# EAGLE design Circuit (EAGLE 9.6.2)
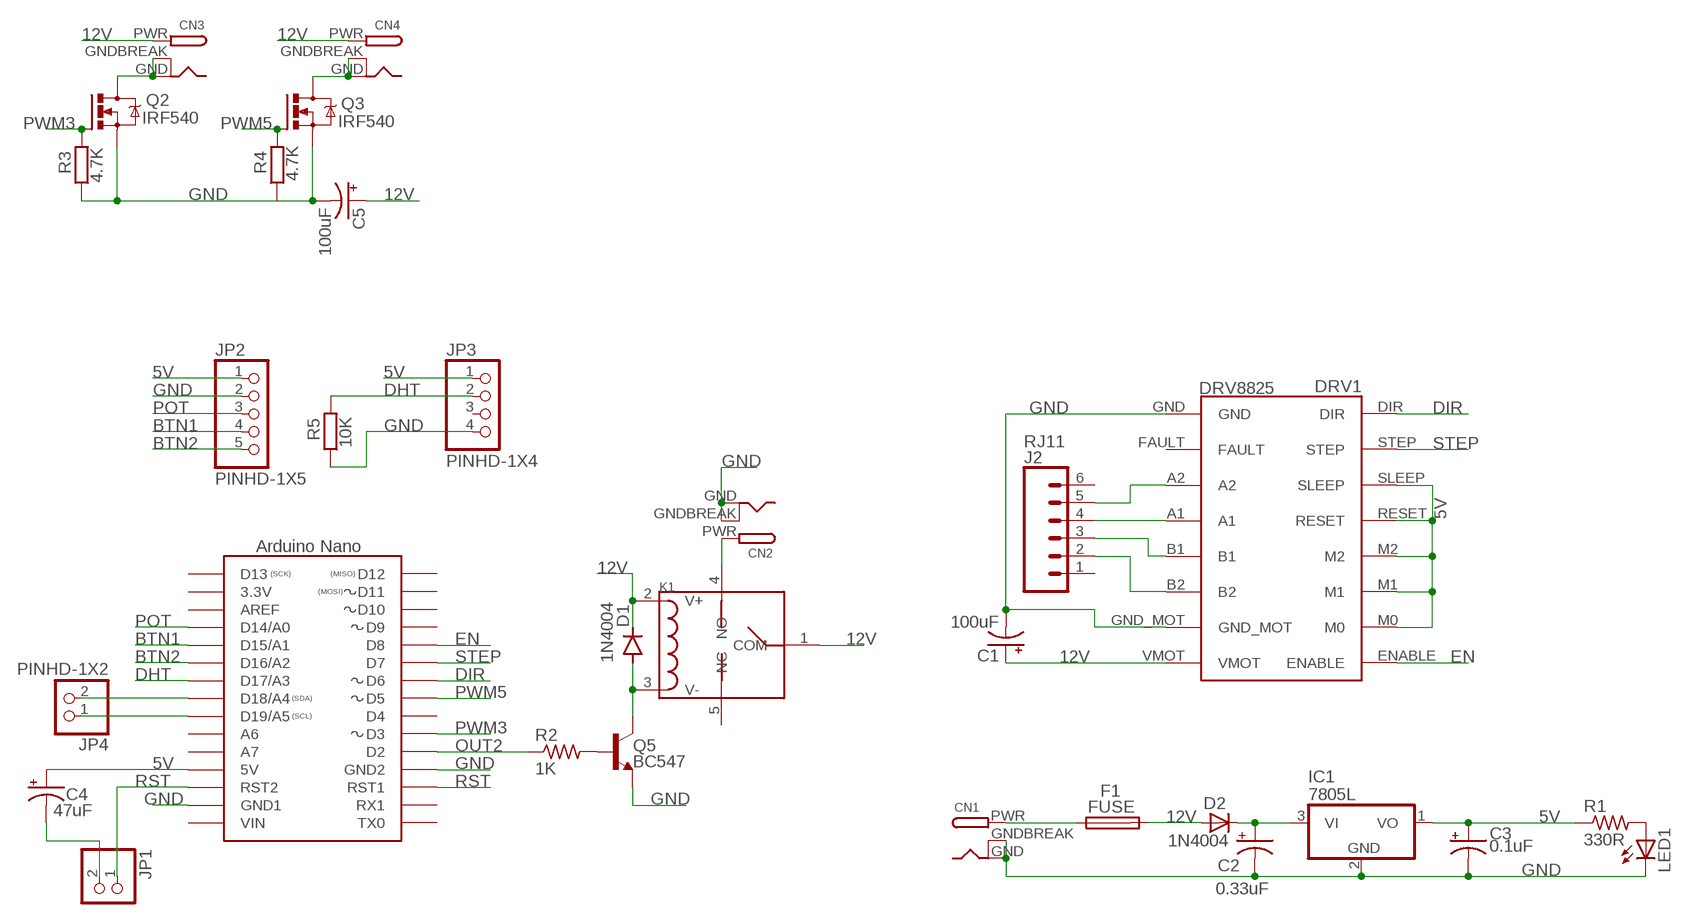
[diagram p0: schematic, sheet 1]

## Parts
C1  100uF  CPOL-USE2.5-6  [E2,5-6]
C2  0.33uF  CPOL-USE2-5  [E2-5]
C3  0.1uF  CPOL-USE2-5  [E2-5]
C4  47uF  CPOL-USE2.5-6  [E2,5-6]
C5  100uF  CPOL-USE2.5-6  [E2,5-6]
CN1  DCBARRELPTH  [DCJACK_2MM_PTH]
CN2  DCBARRELPTH  [DCJACK_2MM_PTH]
CN3  DCBARRELPTH  [DCJACK_2MM_PTH]
CN4  DCBARRELPTH  [DCJACK_2MM_PTH]
D1  1N4004  [DO41-10]
D2  1N4004  [DO41-10]
DRV1  DRV8825  [DRV8825]
F1  FUSE  FUSESH22,5  [SH22,5]
IC1  7805L  [TO92]
J2  RJ11  RJ11-6  [RJ11-6]
JP1  PINHD-1X2  [1X02]
JP2  PINHD-1X5  [1X05]
JP3  PINHD-1X4  [1X04]
JP4  PINHD-1X2  [1X02]
K1  RELAY-HLS8L-DC5V-S-CHLS8L-DC5V-S-C  [REY5-19.0X15.0X15.0MM]
LED1  LED5MM  [LED5MM]
Q2  IRF540  [TO220BV]
Q3  IRF540  [TO220BV]
Q5  BC547  TRANS_NPN-2N3904  [TO-92]
R1  330R  R-US_0204/7  [0204/7]
R2  1K  R-US_0204/7  [0204/7]
R3  4.7K  R-EU_0204/5  [0204/5]
R4  4.7K  R-EU_0204/5  [0204/5]
R5  10K  R-EU_0204/5  [0204/5]
U$1  NANO  [NANO]

## Nets
5V: C3.+ C4.+ DRV1.M0 DRV1.M1 DRV1.M2 DRV1.RESET DRV1.SLEEP IC1.1(VO) JP2.1 JP3.1 R1.1 U$1.5V
12V: C1.+ C5.+ CN3.PWR CN4.PWR D1.C D2.A DRV1.VMOT F1.2 K1.1(COM) K1.2(V+)
BTN1: JP2.4 U$1.A1(D15/A1)
BTN2: JP2.5 U$1.A2(D16/A2)
DHT: JP3.2 R5.2 U$1.A3(D17/A3)
DIR: DRV1.DIR U$1.D6
EN: DRV1.ENABLE U$1.D8
GND: C1.- C2.- C3.- C5.- CN1.GND CN1.GNDBREAK CN2.GND CN2.GNDBREAK DRV1.GND DRV1.GND_MOT IC1.2(GND) JP2.2 JP3.4 LED1.K(C) Q2.S Q3.S Q5.1(E) R3.1 R4.1 R5.1 U$1.GND1(GND2) U$1.GND(GND1)
N$1: LED1.A R1.2
N$2: Q5.2(B) R2.2
N$3: CN2.PWR K1.4(NO)
N$4: JP4.2 U$1.A4(D18/A4)
N$5: DRV1.A1 J2.4
N$6: D1.A K1.3(V-) Q5.3(C)
N$7: JP4.1 U$1.A5(D19/A5)
N$10: C4.- JP1.2
N$13: DRV1.B2 J2.2
N$14: DRV1.B1 J2.3
N$16: DRV1.A2 J2.5
N$19: CN1.PWR F1.1
N$21: CN3.GND CN3.GNDBREAK Q2.D
N$23: CN4.GND CN4.GNDBREAK Q3.D
N$24: C2.+ D2.C IC1.3(VI)
OUT2: R2.1 U$1.D2
POT: JP2.3 U$1.A0(D14/A0)
PWM3: Q2.G R3.2 U$1.D3
PWM5: Q3.G R4.2 U$1.D5
RST: JP1.1 U$1.RST1 U$1.RST(RST2)
STEP: DRV1.STEP U$1.D7
Unconnected: DRV1.FAULT J2.1 J2.6 JP3.3 K1.5(NC) U$1.3.3V U$1.A6 U$1.A7 U$1.AREF U$1.D4 U$1.D9 U$1.D10 U$1.D11 U$1.D12 U$1.D13 U$1.RAW(VIN) U$1.RX1 U$1.TX0

## Library data of the parts
C1-C5 = rcl:CPOL-US: POLARIZED CAPACITOR, American symbol; SPICEPREFIX: C
CN1-CN4 = adafruit:DCBARREL: 2.0mm DC Barrel Jack DCJACK_2MM_PTH - Through Hole Jack (4UConnector: 05537)
D1 = diode:1N4004: DIODE
D2 = adafruit:1N4004: DIODE
DRV1 = 1:DRV8825: DRV8825 Stepper motor driver; SPICEPREFIX: X
F1 = fuse:FUSE: Fuse; OC_FARNELL: unknown; OC_NEWARK: unknown
IC1 = adafruit:78*: Positive VOLTAGE REGULATOR Added bigger pads to the TO-92 package
J2 = SparkFun-Connectors:RJ11-6: RJ11 Jack - 6 pin Commonly found on CAT3 devices and some Microchip programmers. Here is the connector we sell at SparkFun: RJ11 6-Pin Connector <https://www.sparkfun.com/products/132> (PRT-00132) Datasheet <http://www.sparkfun.com/datasheets/Prototyping/Connectors/RJ11-Datasheet.pdf> It is used on this SparkFun product: SparkFun Weather Shield <https://www.sparkfun.com/products/12081> (DEV-12081) Weather Meters <https://www.sparkfun.com/products/8942> (SEN-08942); PROD_ID: CONN-08590; SF_ID: PRT-00132
JP1 = pinhead:PINHD-1X2: PIN HEADER
JP2 = Connector:PINHD-1X5: PIN HEADER; CATEGORY: CONNECTOR; SUB-CATEGORY: PIN-HEADER
JP3 = Connector:PINHD-1X4: PIN HEADER; CATEGORY: CONNECTOR; SUB-CATEGORY: PIN-HEADER
JP4 = Connector:PINHD-1X2: PIN HEADER; CATEGORY: CONNECTOR; SUB-CATEGORY: PIN-HEADER
K1 = OPL_Relay:RELAY-HLS8L-DC5V-S-C: 315030000
LED1 = adafruit:LED: LED OSRAM: - CHIPLED LG R971, LG N971, LY N971, LG Q971, LY Q971, LO R971, LY R971 LH N974, LH R974 LS Q976, LO Q976, LY Q976 LO Q996 - Hyper CHIPLED LW Q18S LB Q993, LB Q99A, LB R99A - SideLED LS A670, LO A670, LY A670, LG A670, LP A670 LB A673, LV A673, LT A673, LW A673 LH A674 LY A675 LS A676, LA A676, LO A676, LY A676, LW A676 LS A679, LY A679, LG A679 - Hyper Micro SIDELED® LS Y876, LA Y876, LO Y876, LY Y876 LT Y87S - SmartLED LW L88C, LW L88S LB L89C, LB L89S, LG L890 LS L89K, LO L89K, LY L89K LS L896, LA L896, LO L896, LY L896 - TOPLED LS T670, LO T670, LY T670, LG T670, LP T670 LSG T670, LSP T670, LSY T670, LOP T670, LYG T670 LG T671, LOG T671, LSG T671 LB T673, LV T673, LT T673, LW T673 LH T674 LS T676, LA T676, LO T676, LY T676, LB T676, LH T676, LSB T676, LW T676 LB T67C, LV T67C, LT T67C, LS T67K, LO T67K, LY T67K, LW E67C LS E67B, LA E67B, LO E67B, LY E67B, LB E67C, LV E67C, LT E67C LW T67C LS T679, LY T679, LG T679 LS T770, LO T770, LY T770, LG T770, LP T770 LB T773, LV T773, LT T773, LW T773 LH T774 LS E675, LA E675, LY E675, LS T675 LS T776, LA T776, LO T776, LY T776, LB T776 LHGB T686 LT T68C, LB T68C - Hyper Mini TOPLED® LB M676 - Mini TOPLED Santana® LG M470 LS M47K, LO M47K, LY M47K Source: http://www.osram.convergy.de/
Q2 Q3 = transistor-power:IRF540: HEXFET Power MOSFET
Q5 = SparkFun-DiscreteSemi:TRANS_NPN: NPN transistor Current controlled devices typically used to amplify current or used as a switch. BC547 - COM-08928 <http://www.sparkfun.com/products/8928> (TO-92 45V 100mA) (1.Collector 2.Base 3.Emitter) 2N3904 - COM-00521 <http://www.sparkfun.com/products/521> (TO-92 40V 200mA) (1.Emitter 2.Base 3.Collector) P2N2222A - COM-12852 <http://www.sparkfun.com/products/12852> (TO-92 40V 600mA) (1.Collector 2.Base 3.Emitter); PROD_ID: TRANS-08447; VALUE: 200mA/40V
R1 R2 = resistor:R-US_: RESISTOR, American symbol
R3-R5 = rcl:R-EU_: RESISTOR, European symbol; SPICEPREFIX: R
U$1 = Arduino:NANO: Arduino Nano

## Board
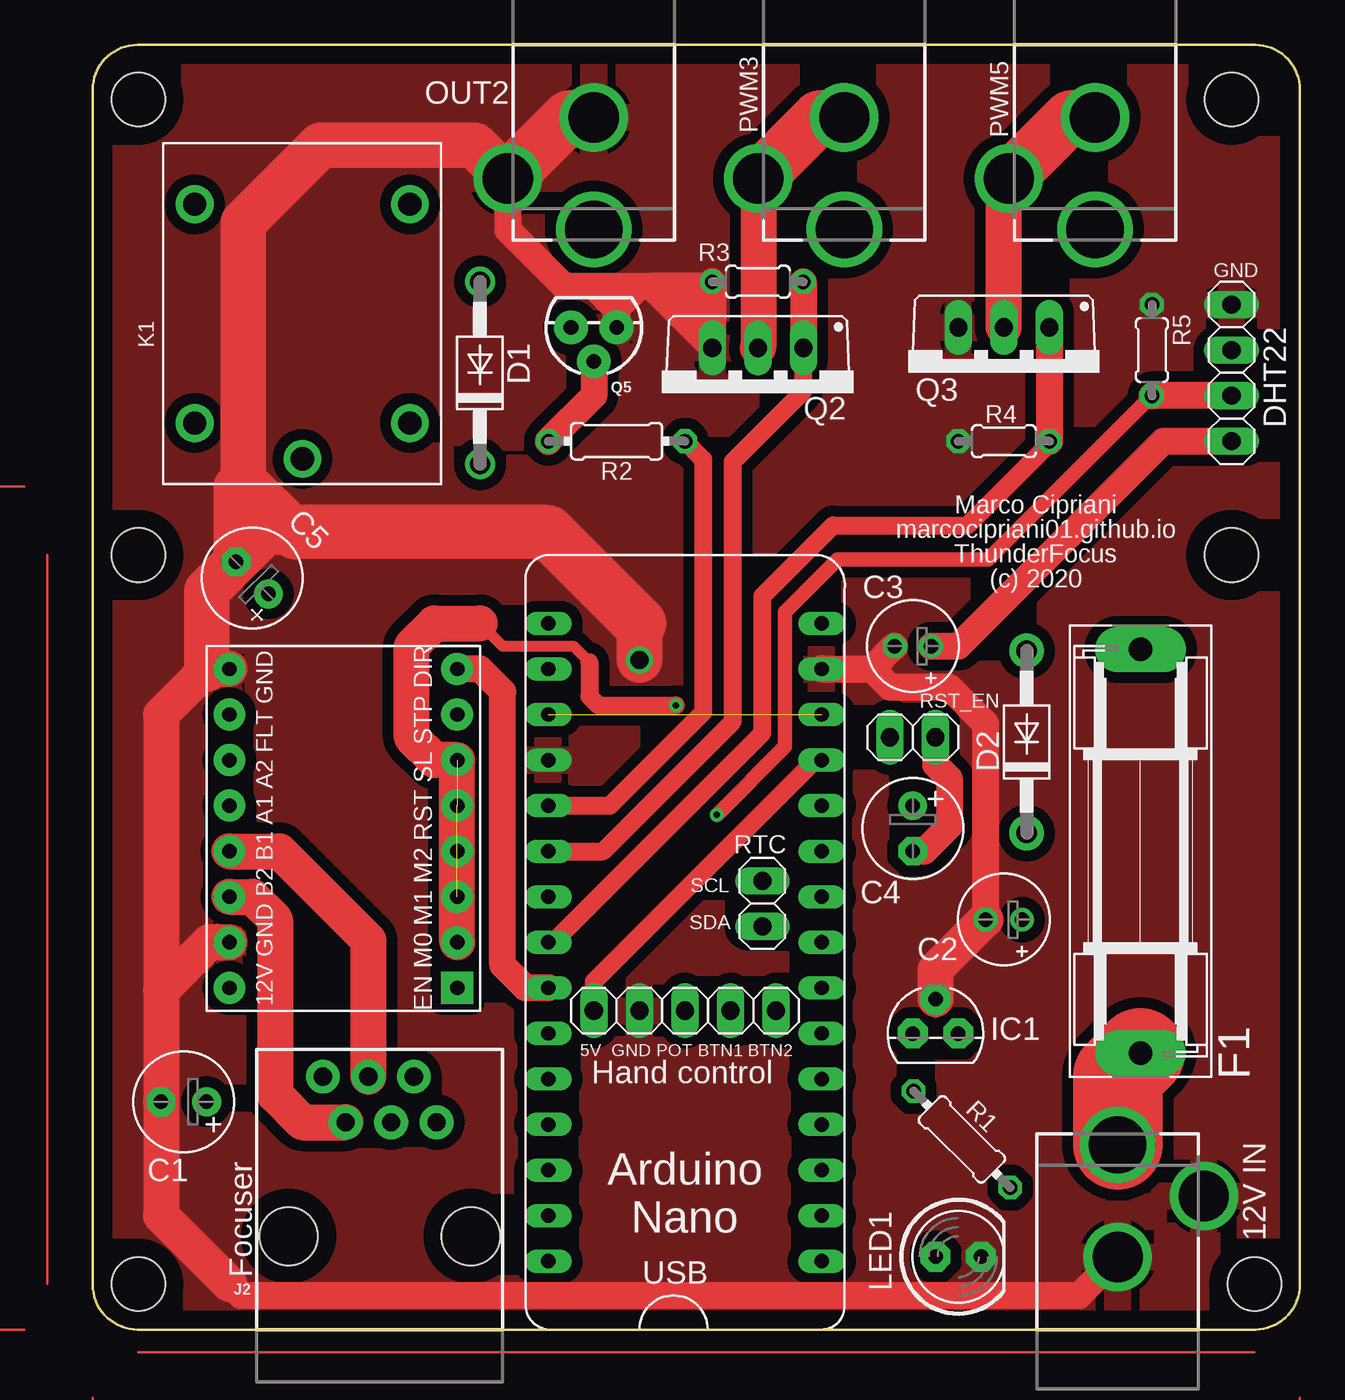
[diagram p1: board, top side]
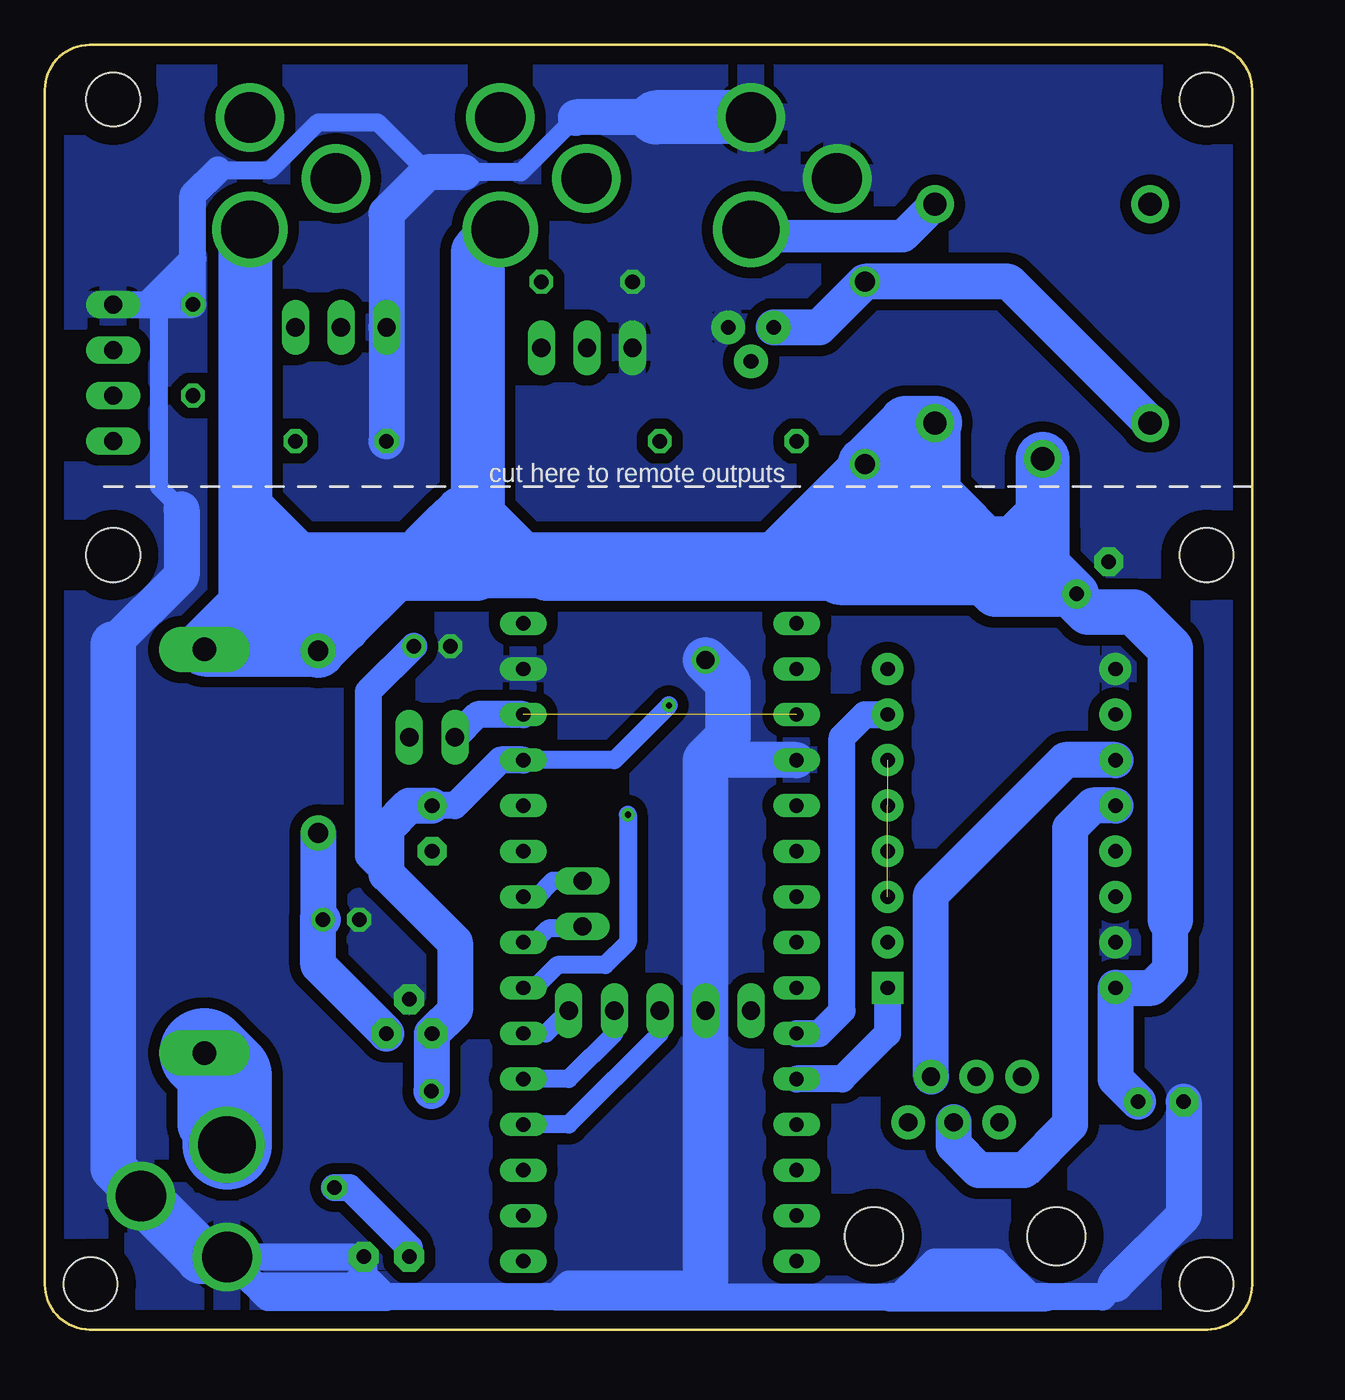
[diagram p2: board, bottom side, seen from below]

Size 67.31 x 71.63 mm. Coordinates in mm from the lower left corner, seen from the top.
Outline: 2.5,0 64.81,0 arc90 67.31,2.5 67.31,69.13 arc90 64.81,71.63 2.5,71.63 arc90 0,69.13 0,2.5 arc90 2.5,0
Copper layers (1*16): Top 0.035mm / dielectric 1.5mm / Bottom 0.035mm
Design rules "default": minimum track width 6mil, minimum drill 0.35mm, track to track 6mil, track to pad 6mil, pad to pad 6mil, via to via 6mil, smd to smd 6mil, copper to edge 40mil, drill to drill 6mil, minimum pad ring 10mil, minimum via ring 8mil, stop-mask expansion 4mil, vias tented up to drill 0mil, thermal gap 10mil
Holes 3 mm at 2.54,43.18 2.54,2.54 64.77,2.54 63.5,43.18 63.5,68.58 2.54,68.58

### Footprints (pad centres in the part's own frame; a part is rotated, then mirrored left to right if it is on the bottom)
E2,5-6 = drill 0.813 pad 1.6: + -1.27,0 | drill 0.813 pad 1.6 octagon: - 1.27,0
E2-5 = drill 0.813 pad 1.27: + -1.016,0 | drill 0.813 pad 1.27 octagon: - 1.016,0
DCJACK_2MM_PTH = drill 2.8: GND 0,7.35; GNDBREAK 4.8,10.75 | drill 3.2: PWR 0,13.6
DO41-10 = drill 1.118: A 5.08,0; C -5.08,0
DO41-10' = drill 1.118 pad 1.93: A 5.08,0; C -5.08,0
DRV8825 = drill 0.8 pad 1.778: A1 13.97,-11.43; A2 13.97,-13.97; B1 13.97,-8.89; B2 13.97,-6.35; DIR 1.27,-19.05; FAULT 13.97,-16.51; GND 13.97,-19.05; GND_MOT 13.97,-3.81; M0 1.27,-3.81; M1 1.27,-6.35; M2 1.27,-8.89; RESET 1.27,-11.43; SLEEP 1.27,-13.97; STEP 1.27,-16.51; VMOT 13.97,-1.27 | drill 0.8 pad 1.778 square: ENABLE 1.27,-1.27
SH22,5 = drill 1.321 pad 2.54 long: 1 -11.252,0; 2 11.252,0
TO92 = drill 0.813 pad 1.676 octagon: 1 -1.27,0; 2 0,1.905; 3 1.27,0
RJ11-6 = drill 1.016 pad 1.88: 1 -3.175,8.89; 2 -1.905,6.35; 3 -0.635,8.89; 4 0.635,6.35; 5 1.905,8.89; 6 3.175,6.35 | hole 3.251: -5.08,0; 5.08,0
1X02 = drill 1.016 long: 1 -1.27,0; 2 1.27,0
1X05 = drill 1.016 long: 1 -5.08,0; 2 -2.54,0; 3 0,0; 4 2.54,0; 5 5.08,0
1X04 = drill 1.016 long: 1 -3.81,0; 2 -1.27,0; 3 1.27,0; 4 3.81,0
REY5-19.0X15.0X15.0MM = drill 1.3 pad 2.1: 1 -8.1,0; 2 -6.1,-6; 3 -6.1,6; 4 6.1,-6; 5 6.1,6
LED5MM = drill 0.813 pad 1.676 octagon: A -1.27,0; K 1.27,0
TO220BV = drill 1.016 long: D 0,-2.54; G -2.54,-2.54; S 2.54,-2.54
TO-92 = drill 0.813 pad 1.88: 1 -1.27,0; 2 0,1.905; 3 1.27,0
0204/7 = drill 0.813 octagon: 1 -3.81,0; 2 3.81,0
0204/5 = drill 0.813 octagon: 1 -2.54,0; 2 2.54,0
NANO = drill 0.8 long: 3.3V 0,33.02; 5V 0,7.62; A0 0,27.94; A1 0,25.4; A2 0,22.86; A3 0,20.32; A4 0,17.78; A5 0,15.24; A6 0,12.7; A7 0,10.16; AREF 0,30.48; D2 15.24,10.16; D3 15.24,12.7; D4 15.24,15.24; D5 15.24,17.78; D6 15.24,20.32; D7 15.24,22.86; D8 15.24,25.4; D9 15.24,27.94; D10 15.24,30.48; D11 15.24,33.02; D12 15.24,35.56; D13 0,35.56; GND 0,2.54; GND1 15.24,7.62; RAW 0,0; RST 0,5.08; RST1 15.24,5.08; RX1 15.24,2.54; TX0 15.24,0

### Placement (x,y rotation side)
C1  5.08,12.7 180 top
C2  50.8,22.86 180 top
C3  45.72,38.1 180 top
C4  45.72,27.94 270 top
C5  8.89,41.91 135 top
CN1  57.15,-3.3 0 top
CN2  27.94,74.93 180 top
CN3  41.91,74.93 180 top
CN4  55.88,74.93 180 top
D1  21.59,53.34 90 top
D2  1N4004  [DO41-10']  52.07,32.77 90 top
DRV1  21.59,17.78 180 top
F1  58.42,26.67 90 top
IC1  46.99,16.51 0 top
J2  16,5.21 0 top
JP1  45.72,33.02 0 top
JP2  33.02,17.78 0 top
JP3  63.5,53.34 90 top
JP4  37.34,23.75 270 top
K1  11.68,56.64 90 top
LED1  48.26,4.06 0 top
Q2  37.08,52.2 180 top
Q3  50.8,53.34 180 top
Q5  27.94,55.88 180 top
R1  48.46,10.6 315 top
R2  29.21,49.53 180 top
R3  37.08,58.42 0 top
R4  50.8,49.53 0 top
R5  59.05,54.61 270 top
U$1  40.64,39.37 180 top

### Tracks (layer width: path | path; a pad name or v marks a point on that pad's centre or on a via)
5V  (via drill 0.35)  (3 unrouted)
  Top 0.61: 21.59,39.37 22.86,38.1 26.8,38.1 27.69,37.21
  Top 1.016: 27.69,37.21 27.69,35.31 28.19,34.8 v32.51,34.8 | JP2.1 27.94,19.41 40.28,31.75 U$1.5V
  Top 1.5: C3.+ 48.26,38.1 59.69,49.53 JP3.1
  Top 2: DRV1.M0 DRV1.SLEEP 19.05,31.75 17.78,33.02 17.78,38.1 19.05,39.37 21.59,39.37
  Bottom 1.016: v32.51,34.8 35.56,31.75 U$1.5V
  Bottom 1.5: U$1.5V 41.91,31.75 44.45,29.21 C4.+ | C3.+ 49.28,35.56 49.28,26.42 48.26,25.4
  Bottom 2: C4.+ 46.99,29.21 48.26,27.94 48.26,25.4 44.45,21.59 44.45,17.78 IC1.1 45.72,13.34 R1.1
12V
  Bottom 2: 4.57,22.86 4.57,20.07 5.59,19.05 DRV1.VMOT 7.62,13.97 C1.+ | 19.68,46.35 19.68,43.18 19.68,42.55 19.05,41.91 | 19.05,45.72 22.86,41.91 22.99,41.91 22.61,42.29 | 11.43,44.45 11.68,44.2 13.97,41.91 | D1.C 21.59,45.72 21.59,44.45 | 21.59,44.45 21.59,43.18 20.32,41.91 | 21.59,44.45 23.75,42.29 | 17.78,44.45 15.24,41.91
  Bottom 2.54: 52.15,37.92 D2.A 53.09,37.85 54.61,39.37 | 27.94,41.91 39.37,41.91 40.64,43.18 | 27.94,41.91 22.99,41.91 | 4.57,22.86 4.57,37.97 6.6,40.01 9.14,40.01 9.79,40.65 C5.+ | 13.97,41.91 11.43,44.45 11.43,43.16 11.68,42.91 | 17.4,44.07 16.51,43.18 | 47.62,42.29 44.96,44.96 | 44.96,44.96 44.2,45.72 43.18,45.72 40.64,43.18 | 43.18,41.91 48.01,41.91 51.89,41.91 55.88,37.92 | 44.96,44.96 44.45,44.45 43.18,44.45 | 55.7,37.92 54.61,37.92 | 54.61,39.37 55.88,40.64 56.13,40.39 58.42,38.1 | 50.67,39.24 50.8,39.37 54.61,39.37 | C5.+ 14.34,41.01 15.24,41.91 | 11.68,42.91 11.68,44.2 | 11.68,42.91 C5.+ | 17.78,44.45 17.4,44.07 | 17.4,44.07 12.83,44.07 | 11.68,45.72 13.72,43.69 13.72,43.43 17.02,43.43 18.16,42.29 43.18,42.29 | 17.78,46.99 13.7,42.91 11.68,42.91 | F1.2 53.16,43.18 | 53.16,43.18 40.64,43.18 | 55.88,43.18 53.16,43.18 | 53.16,43.18 55.7,45.72 56.13,45.72 | 40.64,43.18 19.68,43.18 | D1.C 27.94,41.91 | 21.59,45.72 22.86,44.45
  Bottom 3: CN4.PWR 56.13,61.08 56.13,45.72 56.13,40.39 | CN3.PWR 43.18,60.06 43.18,45.72 | K1.1 11.68,45.72 11.68,44.2 | 52.15,37.92 54.61,37.92 55.88,37.92 F1.2 58.42,38.1 54.61,41.91 | D2.A 50.67,39.24 48.01,41.91 47.62,42.29 43.18,42.29 23.75,42.29 22.61,42.29 | 22.99,41.91 20.32,41.91 19.05,41.91 17.78,41.91 | 17.78,41.91 15.24,41.91 13.97,41.91 | D1.C 19.31,50.54 K1.2 17.78,50.45 17.78,46.99 17.78,44.45 | 17.78,41.91 17.78,44.45 | D1.C 19.68,46.35 19.05,45.72 17.78,44.45 | 19.05,48.26 D1.C
BTN1
  Bottom 1.016: JP2.4 35.56,16.51 38.1,13.97 U$1.A1
BTN2
  Bottom 1.016: JP2.5 39.37,16.51 U$1.A2
DHT  (via drill 0.35)
  Top 0.813: v34.8,28.7 38.61,32.51 38.61,40.01 41.53,42.93 49.91,42.93 R5.2
  Top 1.5: JP3.2 R5.2
  Bottom 1.016: U$1.A3 40.01,19.05 38.73,20.32 36.07,20.32 34.8,21.59 v34.8,28.7
DIR
  Top 1.5: U$1.D6 24.13,19.05 22.86,20.32 22.86,35.56 21.59,36.83 DRV1.DIR
EN
  Bottom 1.5: DRV1.ENABLE 20.32,16.51 22.86,13.97 U$1.D8
GND  (via drill 1)
  Top 1.5: C3.- 43.43,36.83 | U$1.GND 43.43,36.83 | 43.43,36.83 44.45,35.81 47.75,35.81 49.78,33.78 C2.- | CN2.GNDBREAK 23.14,61.31 26.29,58.17 27.94,58.17 | 31.11,58.17 Q2.S R3.1 | 27.94,58.17 29.21,58.17 | 29.21,58.17 30.48,58.17 | 30.48,58.17 31.11,58.17 | 29.21,58.17 Q5.1 29.21,56.9 | 30.48,58.17 29.21,56.9 | 27.94,58.17 29.21,56.9 | R3.1 34.29,58.17 31.11,58.17 | R3.1 33.27,57.15 | 33.02,57.15 33.27,57.15 | 33.27,57.15 34.29,56.13 34.29,55.88 | 7.62,2.54 8.26,1.91 55.01,1.91 CN1.GND
  Top 2: DRV1.GND_MOT 6.48,21.59 3.81,18.92 | 3.81,18.92 C1.- 3.81,6.35 7.62,2.54 | DRV1.GND 6.35,36.83 3.81,34.29 3.81,18.92 | C2.- 46.99,20.07 IC1.2
  Top 2.54: 8.38,47.37 11.3,44.45 9.63,44.45 C5.- | CN2.GNDBREAK 21.28,66.04 12.7,66.04 8.38,61.72 8.38,47.37 | 30.48,39.37 v30.48,37.34 | C5.- 7.99,46.98 8.38,47.37 | C5.- 6.35,41.17 6.35,36.83
  Top 3: 30.48,39.37 25.4,44.45 11.3,44.45 | CN2.GND 26.54,67.58 CN2.GNDBREAK
  Bottom 1.016: 37.72,67.56 40.77,64.52 43.94,64.52 | 57.66,64.64 54.74,64.64 52.07,67.31 48.77,67.31 45.97,64.52 | 60.96,57.15 60.96,46.99 59.69,45.72
  Bottom 1.27: 55.76,2.66 55.64,2.54 50.04,2.54
  Bottom 1.5: 57.15,5.08 CN1.GND | 38.83,1.81 20.28,1.81 | 38.83,1.81 48.3,1.81 49.53,3.05 | 48.26,1.78 54.88,1.78 55.76,2.66 57.17,4.06 LED1.K 49.53,3.05 | 50.04,2.54 49.53,3.05 | 38.83,1.81 38.1,2.54 30.48,2.54 | 11.47,1.81 8.35,1.81 7.62,2.54 | 11.47,1.81 11.43,1.78 20.32,1.78 20.28,1.81 | 11.47,1.81 12.33,1.81 14.27,3.76 17.73,3.76 18.37,3.13 | 18.37,3.13 19.68,1.81 20.28,1.81 | 18.37,3.13 17.78,2.54 13.97,2.54 | 59.05,59.69 R5.1 60.96,57.15 JP3.4 61.59,57.15 59.05,59.69 | 59.05,59.69 59.05,63.25 57.66,64.64 | JP2.2 30.48,19.05
  Bottom 2: C1.- 3.81,6.35 7.62,2.54 | U$1.GND1 30.48,31.75 | 43.94,64.52 45.97,64.52 48.26,62.23 Q3.S R4.1 | 37.72,67.56 37.7,67.58 33.26,67.58 | 59.69,45.72 59.69,42.02 63.5,38.21
  Bottom 2.54: 30.48,2.54 30.48,19.05 30.48,31.75 29.21,33.02 29.21,36.07 v30.48,37.34 | CN1.GNDBREAK 63.5,9 63.5,38.21
  Bottom 3: CN1.GNDBREAK 58.55,4.05 CN1.GND | CN2.GND 33.26,67.58
  pour Bottom (isolate 0.61): 0,71.12 0,0 67.31,0 67.31,71.12
  pour Top (isolate 0.61): 0,71.12 0,0 67.31,0 67.31,71.12
N$1
  Bottom 1.5: LED1.A 46.99,4.57 50.33,7.91 R1.2
N$2
  Top 1.5: Q5.2 27.94,52.07 R2.2
N$3
  Bottom 1.8: CN2.PWR 27.57,60.96 19.47,60.96 K1.4
N$4
  Bottom 1.016: JP4.2 37.47,22.35 39.24,22.35 40.01,21.59 U$1.A4
N$5
  Bottom 2: DRV1.A1 8.89,29.21 10.16,27.94 10.16,11.43 12.7,8.89 15.24,8.89 16.64,10.29 J2.4
N$6
  Bottom 2: K1.3 13.56,58.42 D1.A 24.13,55.88 Q5.3
N$7
  Bottom 1.016: U$1.A5 39.88,24.13 38.99,25.02 JP4.1
N$10
  Top 1.5: JP1.2 46.99,31.5 47.75,30.73 47.75,28.07 46.35,26.67 C4.-
N$13
  Top 2: DRV1.B2 8.89,24.13 10.16,22.86 10.16,13.08 11.68,11.56 J2.2
N$14
  Top 2: DRV1.B1 10.41,26.67 15.37,21.72 J2.3
N$16
  Bottom 2: J2.5 17.91,24.26 10.41,31.75 DRV1.A2
N$19
  Top 5: F1.1 57.15,14.15 CN1.PWR
  Bottom 3: F1.1 58.42,11.43 57.15,10.16
  Bottom 5: CN1.PWR 57.15,14.15 F1.1
N$21
  Top 2: CN3.GNDBREAK 37.11,54.76 Q2.D
  Top 3: CN3.GND 40.51,67.58 CN3.GNDBREAK
N$23
  Top 2: Q3.D 50.8,63.9 CN4.GNDBREAK
  Top 3: CN4.GND 54.48,67.58 CN4.GNDBREAK
N$24
  Bottom 2: D2.C 52.07,23.11 | 52.07,23.11 C2.+ | IC1.3 52.07,20.32 52.07,23.11
OUT2
  Top 1.016: U$1.D2 28.83,29.21 34.04,34.42 34.04,48.51 R2.1
POT
  Bottom 1.016: JP2.3 33.02,16.51 38.1,11.43 U$1.A0
PWM3
  Top 1.016: U$1.D3 28.45,26.67 35.69,33.91 35.69,48.39 39.62,52.32 Q2.G
  Top 1.5: R3.2 Q2.G
PWM5
  Top 1.016: U$1.D5 25.65,21.59 37.34,33.27 37.34,40.89 41.27,44.83 48.77,44.83 53.34,49.4 R4.2
  Top 1.5: Q3.G R4.2
RST  (1 unrouted)
  Bottom 1.5: U$1.RST 43.18,34.29 JP1.1
STEP
  Bottom 1.5: U$1.D7 24.13,16.51 22.86,17.78 22.86,33.02 21.59,34.29 DRV1.STEP
(copper drawn outside any net)
  shapes: Top area x4

### Text on the board
tPlace: PWM3 | PWM5 | OUT2 | GND | DHT22 | RST_EN | RTC | SCL / SDA | 5V GND POT BTN1 BTN2 | Hand control | 12V IN | Focuser
bPlace: cut here to remote outputs
tNames: Marco Cipriani / marcocipriani01.github.io / ThunderFocus / (c) 2020 | 12V GND B2 B1 A1 A2 FLT GND | EN M0 M1 M2 RST SL STP DIR